# Altium schematic sheet Title_Page.SchDoc
size A4; DocumentNumber: 1; SheetNumber: 1; SheetTotal: 9
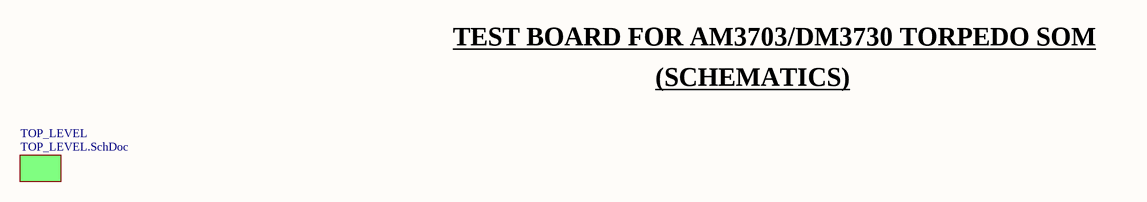
[diagram p0: Title_Page.SchDoc]

## Sub-sheets
TOP_LEVEL = TOP_LEVEL.SchDoc: no entries

## Notes on the sheet
- TEST BOARD FOR AM3703/DM3730 TORPEDO SOM
- (SCHEMATICS)